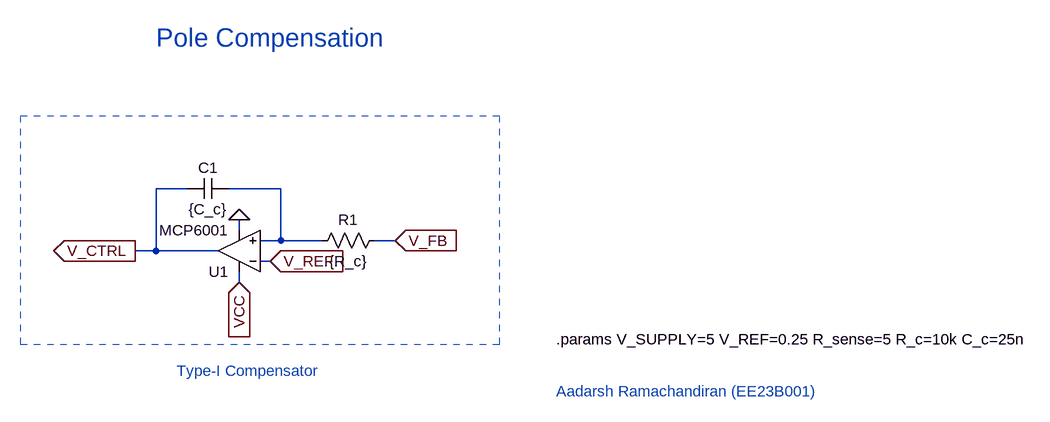
[diagram p0: schematic p3_instance.asc]
p3_instance.asc, the LTspice schematic file:
Version 4.1
SHEET 1 1912 680
WIRE 224 64 176 64
WIRE 368 64 288 64
WIRE 304 128 304 112
WIRE 368 144 368 64
WIRE 368 144 336 144
WIRE 432 144 368 144
WIRE 544 144 512 144
WIRE 176 160 176 64
WIRE 176 160 144 160
WIRE 272 160 176 160
WIRE 352 176 336 176
WIRE 304 208 304 192
FLAG 304 112 0
FLAG 304 208 VCC
IOPIN 304 208 In
FLAG 352 176 V_REF
IOPIN 352 176 In
FLAG 544 144 V_FB
IOPIN 544 144 In
FLAG 144 160 V_CTRL
IOPIN 144 160 Out
SYMBOL Ext_models\\MCP6001 304 160 R180
SYMATTR InstName U1
SYMBOL cap 288 48 R90
WINDOW 0 0 32 VBottom 2
WINDOW 3 32 32 VTop 2
SYMATTR InstName C1
SYMATTR Value {C_c}
SYMBOL res 528 128 R90
WINDOW 0 0 56 VBottom 2
WINDOW 3 32 56 VTop 2
SYMATTR InstName R1
SYMATTR Value {R_c}
TEXT 208 344 Left 2 ;Type-I Compensator
TEXT 792 296 Left 2 !.params V_SUPPLY=5 V_REF=0.25 R_sense=5 R_c=10k C_c=25n
TEXT 176 -168 Left 4 ;Pole Compensation
TEXT 792 376 Left 2 ;Aadarsh Ramachandiran (EE23B001)
RECTANGLE Normal 704 304 -32 -48 2

The netlist it stands for:
* p3_instance.asc
* U1: MCP6001 (symbol Ext_models\MCP6001 not available, pins judged from their places): In+=N001 In-=V_REF V+=VCC V-=0 OUT=V_CTRL
C1 N001 V_CTRL {C_c}
R1 V_FB N001 {R_c}
* Type-I Compensator
.params V_SUPPLY=5 V_REF=0.25 R_sense=5 R_c=10k C_c=25n
* Pole Compensation
* Aadarsh Ramachandiran (EE23B001)
.backanno
.end